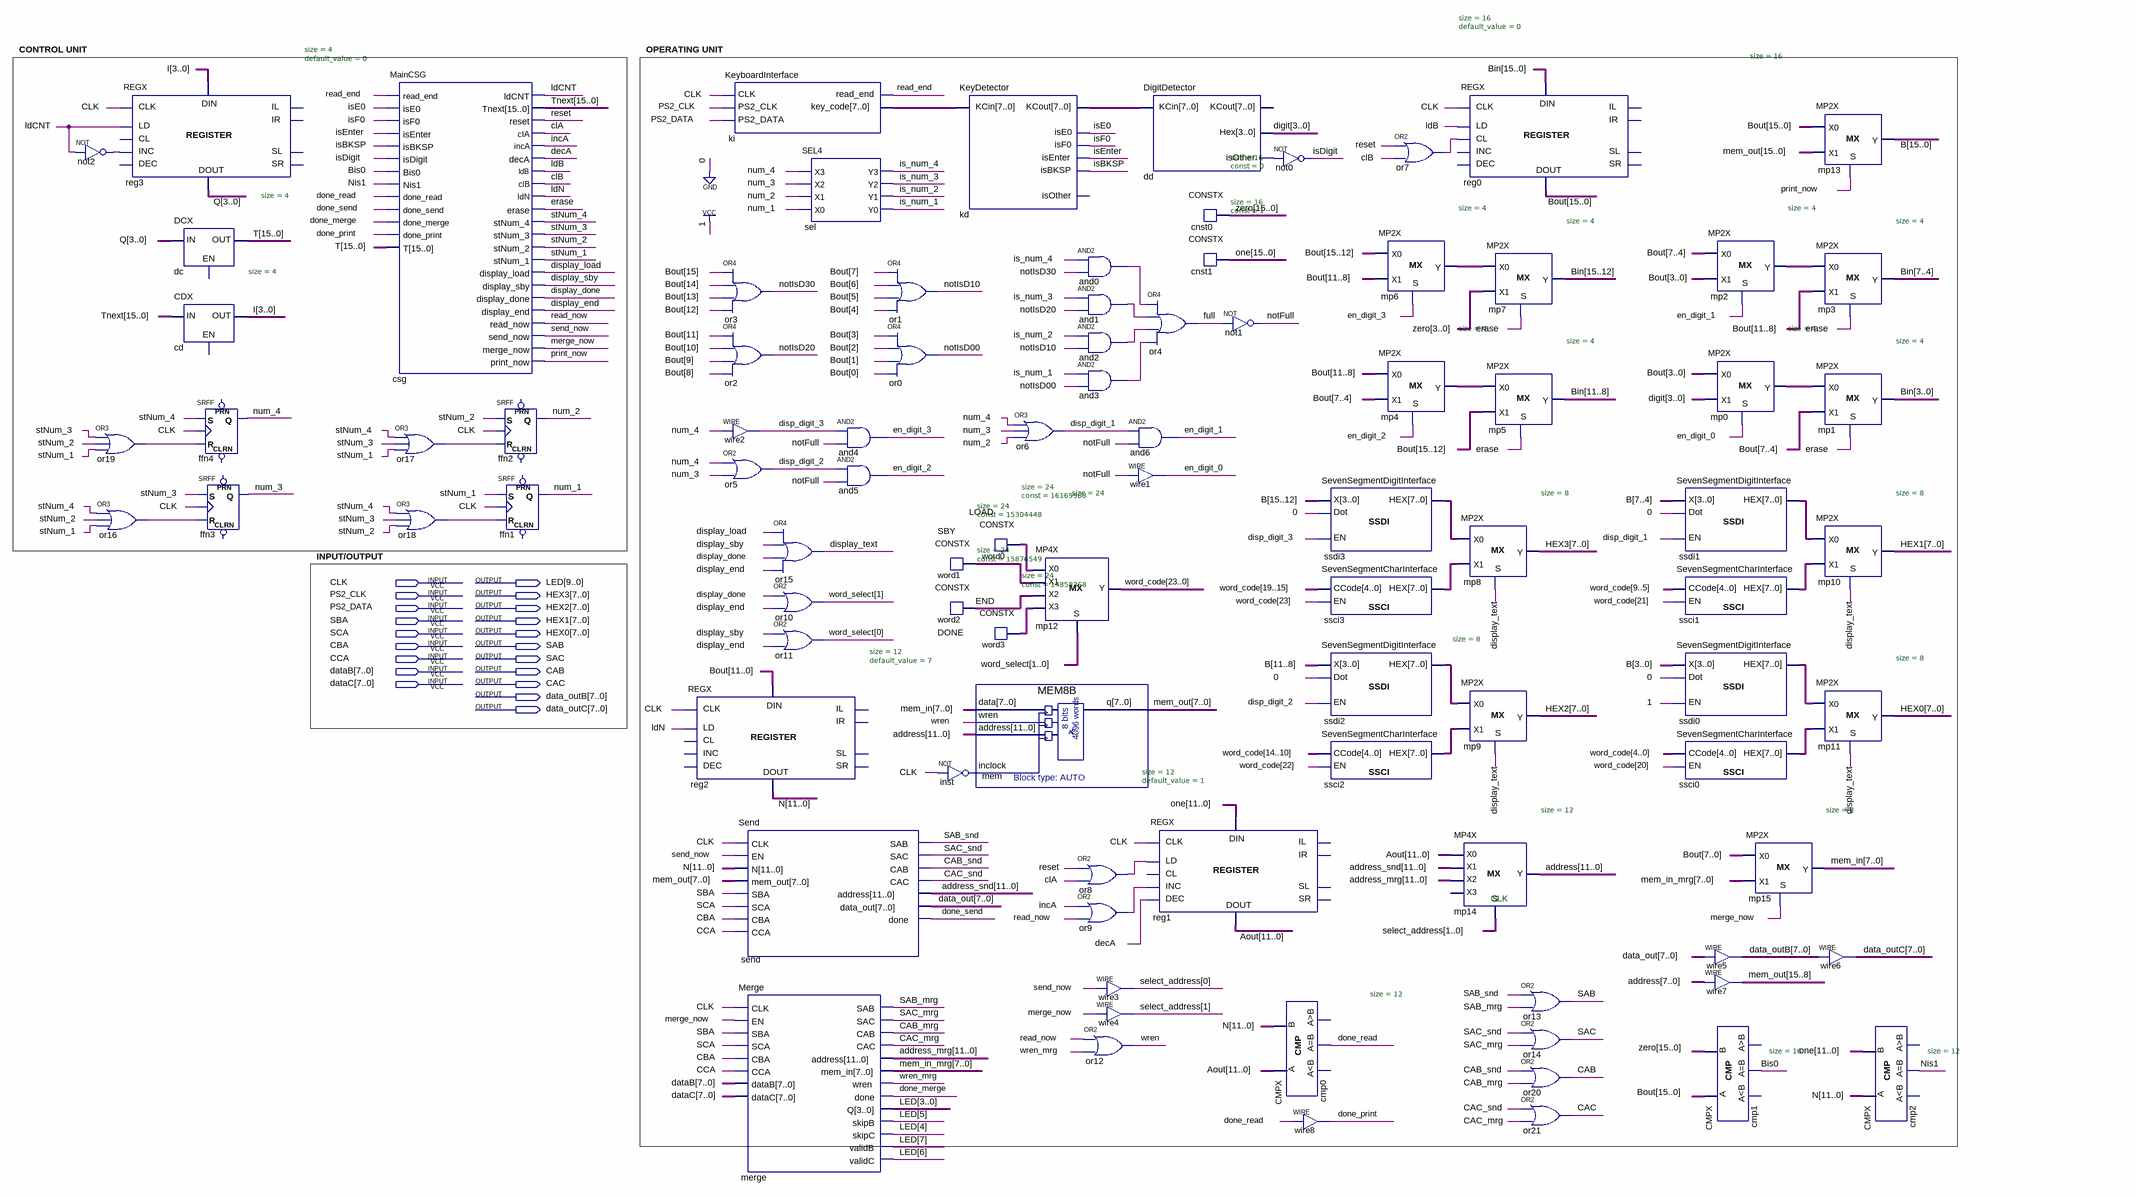
[diagram p0: schematic sheet]
// Quartus schematic ParallelSortManager.bdf as structural Verilog: 92 symbols, 20 pins
module ParallelSortManager (
  input  CLK,
  input  PS2_CLK,
  input  PS2_DATA,
  input  SBA,
  input  SCA,
  input  CBA,
  input  CCA,
  input  [7:0] dataB,
  input  [7:0] dataC,
  output [9:0] LED,
  output [7:0] HEX3,
  output [7:0] HEX2,
  output [7:0] HEX1,
  output [7:0] HEX0,
  output SAB,
  output SAC,
  output CAB,
  output CAC,
  output [7:0] data_outB,
  output [7:0] data_outC
);

  wire and0_out, and1_out, and2_out, and3_out, Bis0, CAB_mrg, CAB_snd, CAC_mrg, CAC_snd, clA, clB,
       dd_isother, decA, disp_digit_1, disp_digit_2, disp_digit_3, display_done, display_end, display_load,
       display_sby, display_text, done_merge, done_print, done_read, done_send, en_digit_0, en_digit_1,
       en_digit_2, en_digit_3, erase, full, incA, inst_out, is_num_1, is_num_2, is_num_3, is_num_4, isBKSP,
       isDigit, isE0, isEnter, isF0, ldB, ldCNT, ldN, merge_now, Nis1, not2_out, notFull, notIsD00, notIsD10,
       notIsD20, notIsD30, num_1, num_2, num_3, num_4, or7_out, or8_out, or9_out, or16_out, or17_out,
       or18_out, or19_out, print_now, read_end, read_now, reset, SAB_mrg, SAB_snd, SAC_mrg, SAC_snd,
       send_now, stNum_1, stNum_2, stNum_3, stNum_4, wren, wren_mrg;
  wire [1:0] select_address, word_select;
  wire [3:0] digit, I, mp0_y, mp2_y, mp4_y, mp6_y, Q;
  wire [7:0] data_out, kd_key_code_out, ki_key_code, mem_in, mem_in_mrg, ssci0_hex, ssci1_hex, ssci2_hex,
       ssci3_hex, ssdi0_hex, ssdi1_hex, ssdi2_hex, ssdi3_hex;
  wire [11:0] address, address_mrg, address_snd, Aout, N;
  wire [15:0] B, Bin, Bout, mem_out, one, T, Tnext, zero;
  wire [23:0] word0_data, word1_data, word2_data, word3_data, word_code;

  not not2 (not2_out, ldCNT);
  or or19 (or19_out, stNum_3, stNum_2, stNum_1);
  or or16 (or16_out, stNum_4, stNum_2, stNum_1);
  REGX #(.size(4), .default_value(0)) reg3 (
    .data_in(I), .clk(CLK), .ld(ldCNT), .inc(not2_out), .data_out(Q));  // open: cl, dec, il, ir, sl, sr
  DCX #(.size(4)) dc (.X(Q), .Y(T));  // open: EN
  CDX #(.size(4)) cd (.X(Tnext), .Y(I));  // open: EN
  SRFF ffn4 (.S(stNum_4), .R(or19_out), .CLK(CLK), .Q(num_4));  // open: PRN, CLRN
  SRFF ffn3 (.S(stNum_3), .R(or16_out), .CLK(CLK), .Q(num_3));  // open: PRN, CLRN
  MainCSG csg (
    .read_end(read_end), .isE0(isE0), .isF0(isF0), .isEnter(isEnter), .isBKSP(isBKSP), .isDigit(isDigit),
    .Bis0(Bis0), .Nis1(Nis1), .done_read(done_read), .done_send(done_send), .done_merge(done_merge),
    .done_print(done_print), .T(T), .ldCNT(ldCNT), .Tnext(Tnext), .reset(reset), .clA(clA), .incA(incA),
    .decA(decA), .ldB(ldB), .clB(clB), .ldN(ldN), .erase(erase), .stNum_4(stNum_4), .stNum_3(stNum_3),
    .stNum_2(stNum_2), .stNum_1(stNum_1), .display_load(display_load), .display_sby(display_sby),
    .display_done(display_done), .display_end(display_end), .read_now(read_now), .send_now(send_now),
    .merge_now(merge_now), .print_now(print_now));
  or or17 (or17_out, stNum_4, stNum_3, stNum_1);
  or or18 (or18_out, stNum_4, stNum_3, stNum_2);
  SRFF ffn2 (.S(stNum_2), .R(or17_out), .CLK(CLK), .Q(num_2));  // open: PRN, CLRN
  SRFF ffn1 (.S(stNum_1), .R(or18_out), .CLK(CLK), .Q(num_1));  // open: PRN, CLRN
  REGX #(.size(12), .default_value(7)) reg2 (
    .data_in(Bout[11:0]), .clk(CLK), .ld(ldN), .data_out(N));  // open: cl, inc, dec, il, ir, sl, sr
  KeyboardInterface ki (.CLK(CLK), .PS2_CLK(PS2_CLK), .PS2_DATA(PS2_DATA), .read_end(read_end), .key_code(ki_key_code));
  or or3 (notIsD30, Bout[15], Bout[14], Bout[13], Bout[12]);
  or or2 (notIsD20, Bout[11], Bout[10], Bout[9], Bout[8]);
  assign disp_digit_3 = num_4;  // WIRE wire2
  or or5 (disp_digit_2, num_4, num_3);
  Send send (
    .CLK(CLK), .EN(send_now), .N(N), .mem_out(mem_out[7:0]), .SBA(SBA), .SCA(SCA), .CBA(CBA), .CCA(CCA),
    .SAB(SAB_snd), .SAC(SAC_snd), .CAB(CAB_snd), .CAC(CAC_snd), .address(address_snd), .data_out(data_out),
    .done(done_send));
  Merge merge (
    .CLK(CLK), .EN(merge_now), .SBA(SBA), .SCA(SCA), .CBA(CBA), .CCA(CCA), .dataB(dataB), .dataC(dataC),
    .SAB(SAB_mrg), .SAC(SAC_mrg), .CAB(CAB_mrg), .CAC(CAC_mrg), .address(address_mrg), .mem_in(mem_in_mrg),
    .wren(wren_mrg), .done(done_merge), .Q(LED[3:0]), .skipB(LED[5]), .skipC(LED[4]), .validB(LED[7]),
    .validC(LED[6]));
  SEL4 sel (.X3(num_4), .X2(num_3), .X1(num_2), .X0(num_1), .Y3(is_num_4), .Y2(is_num_3), .Y1(is_num_2), .Y0(is_num_1));
  or or15 (display_text, display_load, display_sby, display_done, display_end);
  or or10 (word_select[1], display_done, display_end);
  or or11 (word_select[0], display_sby, display_end);
  and and4 (en_digit_3, disp_digit_3, notFull);
  and and5 (en_digit_2, disp_digit_2, notFull);
  or or1 (notIsD10, Bout[7], Bout[6], Bout[5], Bout[4]);
  or or0 (notIsD00, Bout[3], Bout[2], Bout[1], Bout[0]);
  KeyDetector kd (
    .key_code_in(ki_key_code), .isE0(isE0), .isF0(isF0), .isEnter(isEnter), .isBKSP(isBKSP),
    .key_code_out(kd_key_code_out));  // open: isOther
  CONSTX #(.size(24), .\const (15304448)) word1 (.data(word1_data));
  CONSTX #(.size(24), .\const (15876549)) word2 (.data(word2_data));
  not inst (inst_out, CLK);
  or or6 (disp_digit_1, num_4, num_3, num_2);
  CONSTX #(.size(24), .\const (16169988)) word0 (.data(word0_data));
  CONSTX #(.size(24), .\const (14858368)) word3 (.data(word3_data));
  MEM8B mem (.data(mem_in), .wren(wren), .address(address), .inclock(inst_out), .q(mem_out[7:0]));
  MP4X #(.size(24)) mp12 (
    .X0(word0_data), .X1(word1_data), .X2(word2_data), .X3(word3_data), .S(word_select), .Y(word_code));
  and and0 (and0_out, is_num_4, notIsD30);
  and and1 (and1_out, is_num_3, notIsD20);
  and and2 (and2_out, is_num_2, notIsD10);
  and and3 (and3_out, is_num_1, notIsD00);
  or or8 (or8_out, reset, clA);
  or or9 (or9_out, incA, read_now);
  assign select_address[0] = send_now;  // WIRE wire3
  assign select_address[1] = merge_now;  // WIRE wire4
  or or12 (wren, read_now, wren_mrg);
  DigitDetector dd (.key_code_in(kd_key_code_out), .digit_out(digit), .isOther(dd_isother));  // open: key_code_out
  or or4 (full, and0_out, and1_out, and2_out, and3_out);
  and and6 (en_digit_1, disp_digit_1, notFull);
  assign en_digit_0 = notFull;  // WIRE wire1
  REGX #(.size(12), .default_value(1)) reg1 (
    .data_in(one[11:0]), .clk(CLK), .ld(or8_out), .inc(or9_out), .dec(decA), .data_out(Aout));  // open: cl, il, ir, sl, sr
  CONSTX #(.size(16), .\const (0)) cnst0 (.data(zero));
  CONSTX #(.size(16), .\const (1)) cnst1 (.data(one));
  not not1 (notFull, full);
  not not0 (isDigit, dd_isother);
  SevenSegmentDigitInterface ssdi3 (.x(B[15:12]), .dot(1'b0), .en(disp_digit_3), .hex(ssdi3_hex));
  SevenSegmentCharInterface ssci3 (.x(word_code[19:15]), .en(word_code[23]), .hex(ssci3_hex));
  SevenSegmentDigitInterface ssdi2 (.x(B[11:8]), .dot(1'b0), .en(disp_digit_2), .hex(ssdi2_hex));
  SevenSegmentCharInterface ssci2 (.x(word_code[14:10]), .en(word_code[22]), .hex(ssci2_hex));
  CMPX #(.size(12)) cmp0 (.A(Aout), .B(N), .eq(done_read));  // open: ls, gr
  assign done_print = done_read;  // WIRE wire8
  or or7 (or7_out, reset, clB);
  MP2X #(.size(4)) mp6 (.S(en_digit_3), .X0(Bout[15:12]), .X1(Bout[11:8]), .Y(mp6_y));
  MP2X #(.size(4)) mp4 (.S(en_digit_2), .X0(Bout[11:8]), .X1(Bout[7:4]), .Y(mp4_y));
  REGX #(.size(16), .default_value(0)) reg0 (
    .data_in(Bin), .clk(CLK), .ld(ldB), .cl(or7_out), .data_out(Bout));  // open: inc, dec, il, ir, sl, sr
  MP2X #(.size(8)) mp8 (.S(display_text), .X0(ssdi3_hex), .X1(ssci3_hex), .Y(HEX3));
  MP2X #(.size(8)) mp9 (.S(display_text), .X0(ssdi2_hex), .X1(ssci2_hex), .Y(HEX2));
  MP4X #(.size(12)) mp14 (.X0(Aout), .X1(address_snd), .X2(address_mrg), .S(select_address), .Y(address));  // open: X3
  MP2X #(.size(4)) mp7 (.S(erase), .X0(mp6_y), .X1(zero[3:0]), .Y(Bin[15:12]));
  MP2X #(.size(4)) mp5 (.S(erase), .X0(mp4_y), .X1(Bout[15:12]), .Y(Bin[11:8]));
  or or13 (SAB, SAB_snd, SAB_mrg);
  or or14 (SAC, SAC_snd, SAC_mrg);
  or or20 (CAB, CAB_snd, CAB_mrg);
  or or21 (CAC, CAC_snd, CAC_mrg);
  SevenSegmentDigitInterface ssdi1 (.x(B[7:4]), .dot(1'b0), .en(disp_digit_1), .hex(ssdi1_hex));
  SevenSegmentCharInterface ssci1 (.x(word_code[9:5]), .en(word_code[21]), .hex(ssci1_hex));
  SevenSegmentDigitInterface ssdi0 (.x(B[3:0]), .dot(1'b0), .en(1'b1), .hex(ssdi0_hex));
  SevenSegmentCharInterface ssci0 (.x(word_code[4:0]), .en(word_code[20]), .hex(ssci0_hex));
  MP2X #(.size(4)) mp2 (.S(en_digit_1), .X0(Bout[7:4]), .X1(Bout[3:0]), .Y(mp2_y));
  MP2X #(.size(4)) mp0 (.S(en_digit_0), .X0(Bout[3:0]), .X1(digit), .Y(mp0_y));
  assign data_outB = data_out;  // WIRE wire5
  assign mem_out[15:8] = address[7:0];  // WIRE wire7
  CMPX #(.size(16)) cmp1 (.A(Bout), .B(zero), .eq(Bis0));  // open: ls, gr
  MP2X #(.size(8)) mp15 (.S(merge_now), .X0(Bout[7:0]), .X1(mem_in_mrg), .Y(mem_in));
  MP2X #(.size(16)) mp13 (.S(print_now), .X0(Bout), .X1(mem_out), .Y(B));
  MP2X #(.size(4)) mp3 (.S(erase), .X0(mp2_y), .X1(Bout[11:8]), .Y(Bin[7:4]));
  MP2X #(.size(4)) mp1 (.S(erase), .X0(mp0_y), .X1(Bout[7:4]), .Y(Bin[3:0]));
  MP2X #(.size(8)) mp10 (.S(display_text), .X0(ssdi1_hex), .X1(ssci1_hex), .Y(HEX1));
  MP2X #(.size(8)) mp11 (.S(display_text), .X0(ssdi0_hex), .X1(ssci0_hex), .Y(HEX0));
  assign data_outC = data_outB;  // WIRE wire6
  CMPX #(.size(12)) cmp2 (.A(N), .B(one[11:0]), .eq(Nis1));  // open: ls, gr

  // Notes on the sheet:
  //   CONTROL UNIT
  //   OPERATING UNIT
  //   LOAD
  //   SBY
  //   INPUT/OUTPUT
  //   END
  //   DONE
  //   CLK
endmodule
